# Altium project PCB_Project1.PrjPCB
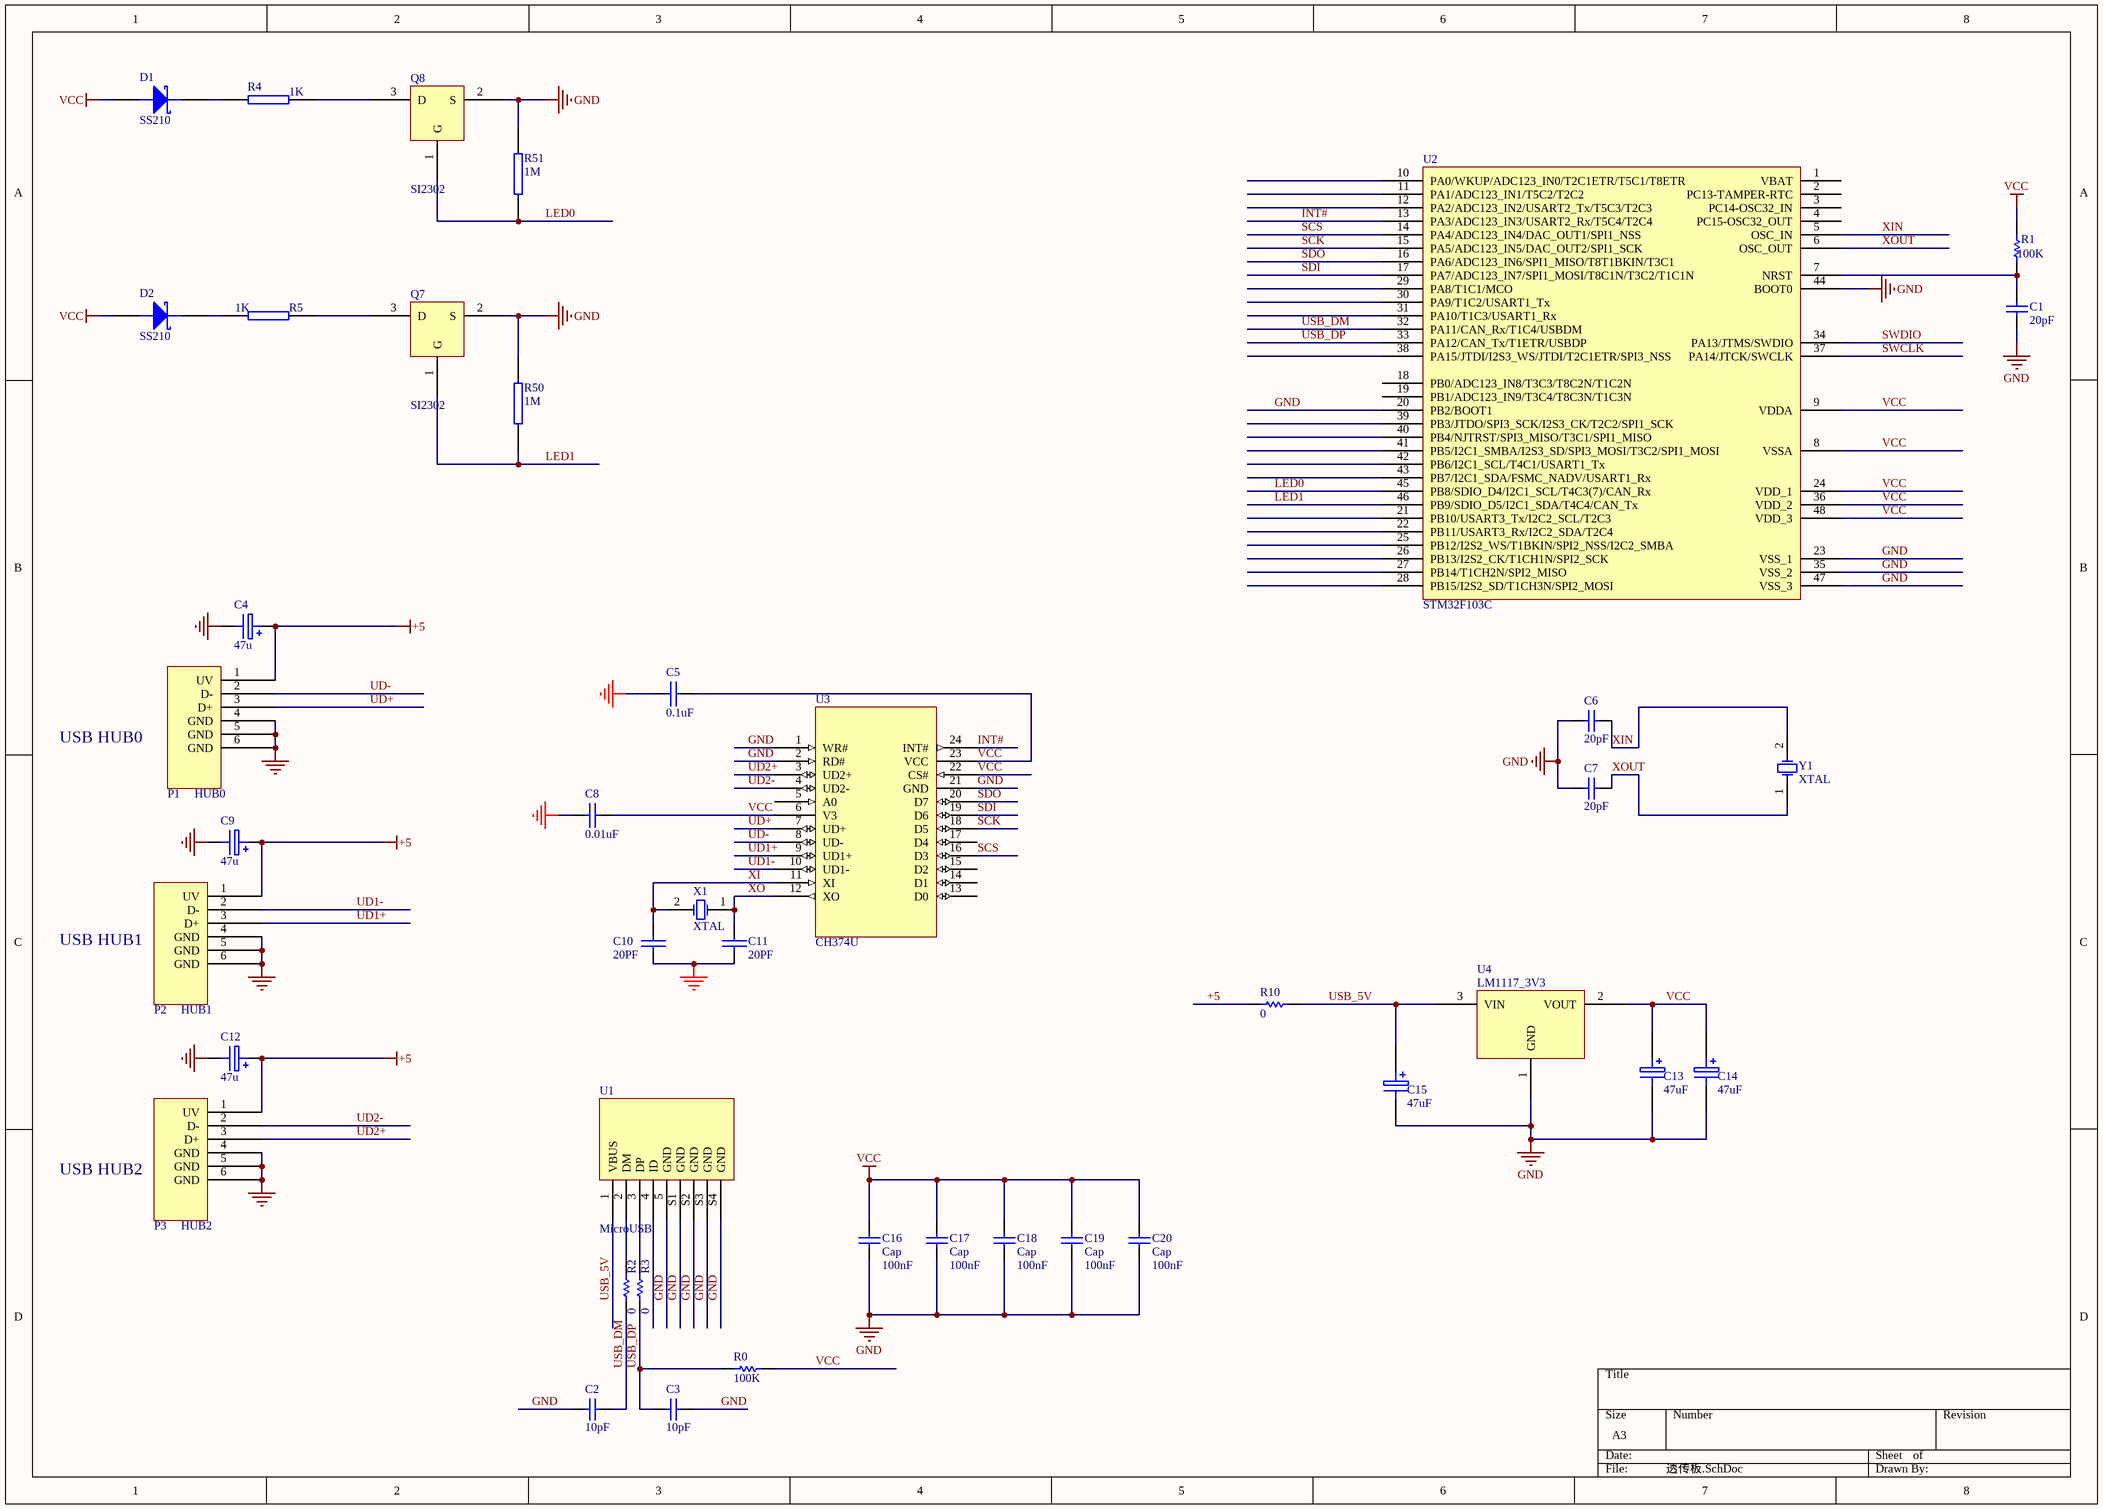
[diagram p0: 透传板.SchDoc]
1 sheet, 42 parts. Net scope: global (net labels, ports and power ports of the same name join across sheets).
Board file: USB转换器.PcbDoc

## Sheet 透传板.SchDoc
size A3

### Parts
C1  20pF  [0402S]
C2  10pF  [0402S]
C3  10pF  [0402S]
C4  47u  [3216C]
C5  0.1uF  [0805]
C6  20pF  [0402S]
C7  20pF  [0402S]
C8  0.01uF  [0805]
C9  47u  [3216C]
C10  20PF  [0402S]
C11  20PF  [0402S]
C12  47u  [3216C]
C13  47uF  [3216C]
C14  47uF  [3216C]
C15  47uF  [3216C]
C16  Cap  value 100nF  [0402S]
C17  Cap  value 100nF  [0402S]
C18  Cap  value 100nF  [0402S]
C19  Cap  value 100nF  [0402S]
C20  Cap  value 100nF  [0402S]
D1  SS210  [7227D]
D2  SS210  [7227D]
P1  USB  [USBA]  (value not drawn)
P2  USB  [USBA]  (value not drawn)
P3  USB  [USBA]  (value not drawn)
Q7  SI2302  [SOT23A]
Q8  SI2302  [SOT23A]
R0  value 100K  [0402S]  (hidden comment: Res1)
R1  value 100K  [0402S]  (hidden comment: Res1)
R2  value 0  [0402S]  (hidden comment: Res1)
R3  value 0  [0402S]  (hidden comment: Res1)
R4  1K  [0805]
R5  1K  [0805]
R10  value 0  [3216C]  (hidden comment: Res1)
R50  1M  [0402S]
R51  1M  [0402S]
U1  MicroUSB  [Micro-USB]
U2  STM32F103C  [LQFP-48_M]
U3  CH374U  [SSOP24]
U4  LM1117_3V3  [SOT-223]
X1  XTAL  [3225_无源]
Y1  XTAL  [3225_无源]

### Nets
+5: C4.1 C9.1 C12.1 P1.1(UV) P2.1(UV) P3.1(UV) R10.2
GND: C1.2 C2.2 C3.2 C4.2 C5.2 C6.2 C7.2 C8.2 C9.2 C10.2 C11.2 C12.2 C13.2 C14.2 C15.2 C16.1 C17.1 C18.1 C19.1 C20.1 P1.4(GND) P1.5(GND) P1.6(GND) P2.4(GND) P2.5(GND) P2.6(GND) P3.4(GND) P3.5(GND) P3.6(GND) Q7.2(S) Q8.2(S) R50.1 R51.1 U1.5(GND) U1.S1(GND) U1.S2(GND) U1.S3(GND) U1.S4(GND) U2.20(PB2/BOOT1) U2.23(VSS_1) U2.35(VSS_2) U2.44(BOOT0) U2.47(VSS_3) U3.1(WR#) U3.2(RD#) U3.21(GND) U4.1(GND)
VCC: C5.1 C8.1 C13.1 C14.1 C16.2 C17.2 C18.2 C19.2 C20.2 D1.1(A) D2.1(A) R0.1 R1.2 U2.8(VSSA) U2.9(VDDA) U2.24(VDD_1) U2.36(VDD_2) U2.48(VDD_3) U3.6(V3) U3.22(CS#) U3.23(VCC) U4.2(VOUT)
INT#: U2.13(PA3/ADC123_IN3/USART2_Rx/T5C4/T2C4) U3.24(INT#)
LED0: Q8.1(G) R51.2 U2.45(PB8/SDIO_D4/I2C1_SCL/T4C3(7)/CAN_Rx)
LED1: Q7.1(G) R50.2 U2.46(PB9/SDIO_D5/I2C1_SDA/T4C4/CAN_Tx)
SCK: U2.15(PA5/ADC123_IN5/DAC_OUT2/SPI1_SCK) U3.18(D5)
SCS: U2.14(PA4/ADC123_IN4/DAC_OUT1/SPI1_NSS) U3.16(D3)
SDI: U2.17(PA7/ADC123_IN7/SPI1_MOSI/T8C1N/T3C2/T1C1N) U3.19(D6)
SDO: U2.16(PA6/ADC123_IN6/SPI1_MISO/T8T1BKIN/T3C1) U3.20(D7)
SWCLK: U2.37(PA14/JTCK/SWCLK)
SWDIO: U2.34(PA13/JTMS/SWDIO)
UD1+: P2.3(D+) U3.9(UD1+)
UD1-: P2.2(D-) U3.10(UD1-)
UD2+: P3.3(D+) U3.3(UD2+)
UD2-: P3.2(D-) U3.4(UD2-)
UD+: P1.3(D+) U3.7(UD+)
UD-: P1.2(D-) U3.8(UD-)
USB_5V: C15.1 R10.1 U1.1(VBUS) U4.3(VIN)
USB_DM: C2.1 R2.2 U2.32(PA11/CAN_Rx/T1C4/USBDM)
USB_DP: C3.1 R0.2 R3.2 U2.33(PA12/CAN_Tx/T1ETR/USBDP)
XI: C10.1 U3.11(XI) X1.2(OSC2)
XIN: C6.1 U2.5(OSC_IN) Y1.2(OSC2)
XO: C11.1 U3.12(XO) X1.1(OSC1)
XOUT: C7.1 U2.6(OSC_OUT) Y1.1(OSC1)
NetC1_1: C1.1 R1.1 U2.7(NRST)
NetD1_2: D1.2(K) R4.2
NetD2_2: D2.2(K) R5.2
NetQ7_3: Q7.3(D) R5.1
NetQ8_3: Q8.3(D) R4.1
NetR2_1: R2.1 U1.2(DM)
NetR3_1: R3.1 U1.3(DP)

Not connected (* = marked no-connect by the designer): U1 4(ID); U2 1(VBAT) 2(PC13-TAMPER-RTC) 3(PC14-OSC32_IN) 4(PC15-OSC32_OUT) 10(PA0/WKUP/ADC123_IN0/T2C1ETR/T5C1/T8ETR) 11(PA1/ADC123_IN1/T5C2/T2C2) 12(PA2/ADC123_IN2/USART2_Tx/T5C3/T2C3) 18(PB0/ADC123_IN8/T3C3/T8C2N/T1C2N) 19(PB1/ADC123_IN9/T3C4/T8C3N/T1C3N) 21(PB10/USART3_Tx/I2C2_SCL/T2C3) 22(PB11/USART3_Rx/I2C2_SDA/T2C4) 25(PB12/I2S2_WS/T1BKIN/SPI2_NSS/I2C2_SMBA) 26(PB13/I2S2_CK/T1CH1N/SPI2_SCK) 27(PB14/T1CH2N/SPI2_MISO) 28(PB15/I2S2_SD/T1CH3N/SPI2_MOSI) 29(PA8/T1C1/MCO) 30(PA9/T1C2/USART1_Tx) 31(PA10/T1C3/USART1_Rx) 38(PA15/JTDI/I2S3_WS/JTDI/T2C1ETR/SPI3_NSS) 39(PB3/JTDO/SPI3_SCK/I2S3_CK/T2C2/SPI1_SCK) 40(PB4/NJTRST/SPI3_MISO/T3C1/SPI1_MISO) 41(PB5/I2C1_SMBA/I2S3_SD/SPI3_MOSI/T3C2/SPI1_MOSI) 42(PB6/I2C1_SCL/T4C1/USART1_Tx) 43(PB7/I2C1_SDA/FSMC_NADV/USART1_Rx); U3 5(A0) 13(D0) 14(D1) 15(D2) 17(D4)

### Notes on the sheet
- USB HUB0
- HUB0
- USB HUB1
- HUB1
- USB HUB2
- (near P3) HUB2

### Library data of the parts
C1-C3 C6 C7 = Capacitor_ST: Capacitor 0402 / 0603 / 0805; Value: 100nF; Revision: July-2002: Re-released for DXP Platform.
C4 C9 C12 = CAP470U
C5 C8 C10 C11 = CAP: Capacitor
C13-C15 = ELECTRO1: Electrolytic Capacitor
C16-C20 = Cap: Capacitor; Published: 8-Jun-2000; LatestRevisionDate: 17-Jul-2002; LatestRevisionNote: Re-released for DXP Platform.; PackageReference: RAD-0.3; Publisher: Altium Limited
D1 D2 = DIODE SCHOTTKY: Schottky Diode
P1-P3 = USB2
R0-R3 R10 = Res1: Resistor; Published: 8-Jun-2000; LatestRevisionDate: 17-Jul-2002; LatestRevisionNote: Re-released for DXP Platform.; PackageReference: AXIAL-0.3; Publisher: Altium Limited
R4 R5 R50 R51 = RES2
U2 = STM32F103C: STM32单片机48引脚
U4 = LM1117_3.3V
X1 Y1 = XTAL: Crystal Oscillator; Published: 8-Jun-2000; LatestRevisionDate: 17-Jul-2002; LatestRevisionNote: Re-released for DXP Platform.; PackageReference: R38; Publisher: Altium Limited